# Altium project RezzGlassesControlCircuit_V1.PrjPcb
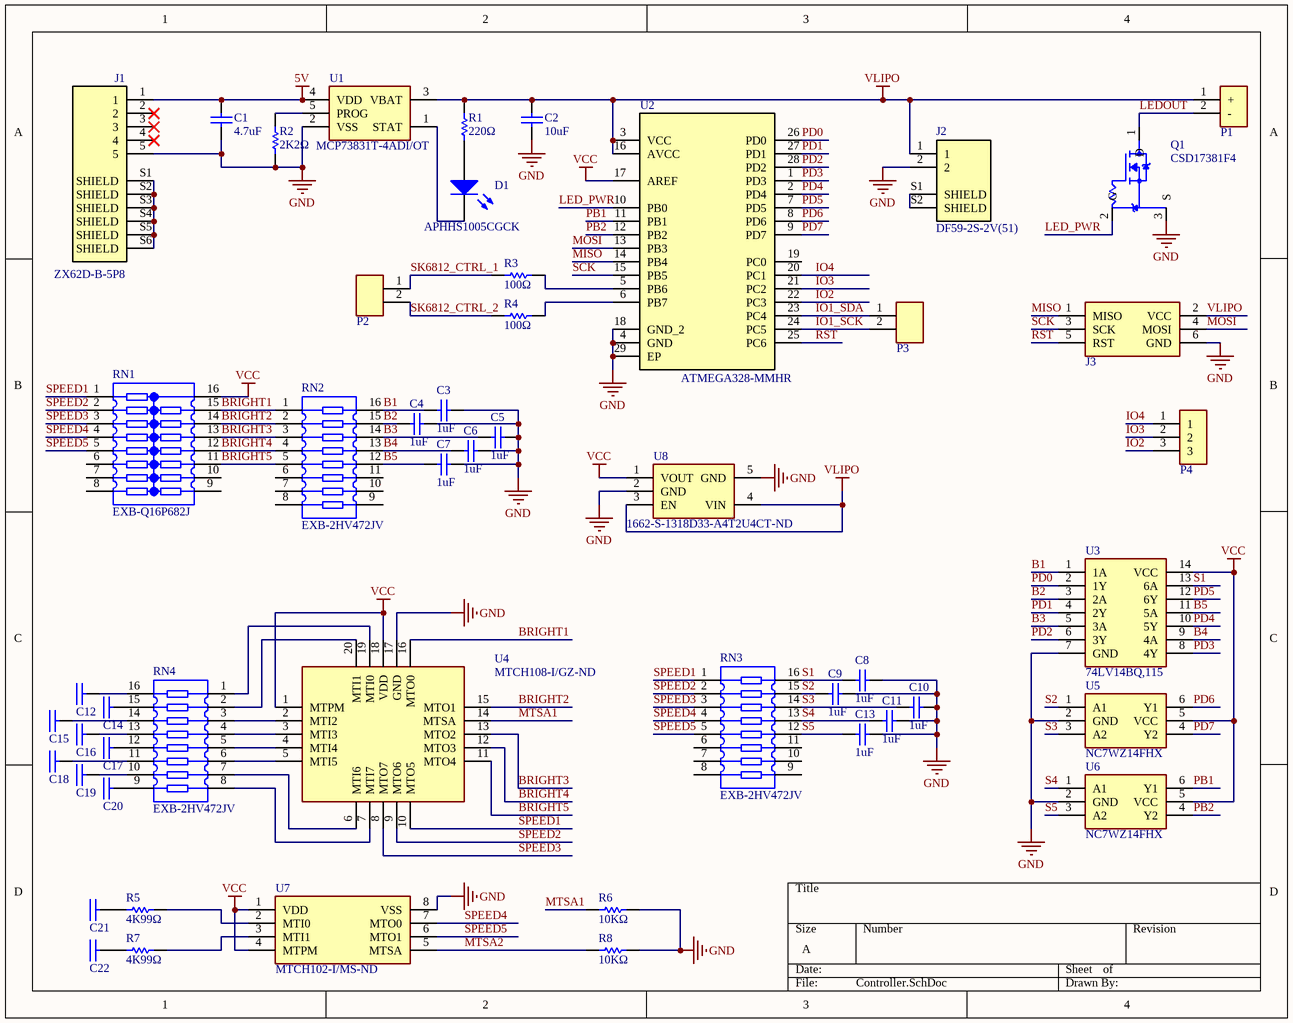
[diagram p0: Controller.SchDoc]
1 sheet, 51 parts. Net scope: global (net labels, ports and power ports of the same name join across sheets).
Board file: ControllerMain_V1.PcbDoc

## Sheet Controller.SchDoc
size A; SheetNumber: 1; SheetTotal: 4

### Parts
C1  4.7uF  [0603_CAP]
C2  10uF  [0603_CAP]
C3  1uF  [0603_CAP]
C4  1uF  [0603_CAP]
C5  1uF  [0603_CAP]
C6  1uF  [0603_CAP]
C7  1uF  [0603_CAP]
C8  1uF  [0603_CAP]
C9  1uF  [0603_CAP]
C10  1uF  [0603_CAP]
C11  1uF  [0603_CAP]
C12  Human Body Model  [TOUCHSENSE_SLIDE1-END2]  (value not drawn)
C13  1uF  [0603_CAP]
C14  Human Body Model  [TOUCHSENSE_SLIDE1]  (value not drawn)
C15  Human Body Model  [TOUCHSENSE_SLIDE1]  (value not drawn)
C16  Human Body Model  [TOUCHSENSE_SLIDE1]  (value not drawn)
C17  Human Body Model  [TOUCHSENSE_SLIDE1]  (value not drawn)
C18  Human Body Model  [TOUCHSENSE_SLIDE1]  (value not drawn)
C19  Human Body Model  [TOUCHSENSE_SLIDE1]  (value not drawn)
C20  Human Body Model  [TOUCHSENSE_SLIDE1]  (value not drawn)
C21  Human Body Model  [TOUCHSENSE_SLIDE1]  (value not drawn)
C22  Human Body Model  [TOUCHSENSE_SLIDE1-END1]  (value not drawn)
D1  APHHS1005CGCK  [0402-LED-G]
J1  ZX62D-B-5P8  [Micro_USB]
J2  DF59-2S-2V(51)  [SNAPBEE_DF59-2S-2V]
J3  6 Pin ISP Header  [CONN_ISP_TINY]  (value not drawn)
P1  HEADER_1x2_POLAR  [PIN2]  (value not drawn)
P2  HEADER_1x2  [PIN2]  (value not drawn)
P3  HEADER_1x2  [PIN2]  (value not drawn)
P4  HEADER_1x3  [PIN3]  (value not drawn)
Q1  CSD17381F4  [PICOSTAR-3]
R1  220Ω  [0603_RES]
R2  2K2Ω  [0603_RES]
R3  100Ω  [0603_RES]
R4  100Ω  [0603_RES]
R5  4K99Ω  [0603_RES]
R6  10KΩ  [0603_RES]
R7  4K99Ω  [0603_RES]
R8  10KΩ  [0603_RES]
RN1  EXB-Q16P682J  [RES-ARRAY-16_EXB]
RN2  EXB-2HV472JV  [RES-ARRAY-16_EXB]
RN3  EXB-2HV472JV  [RES-ARRAY-16_EXB]
RN4  EXB-2HV472JV  [RES-ARRAY-16_EXB]
U1  MCP73831T-4ADI/OT  [SOT-23-5-N]
U2  ATMEGA328-MMHR  [QFN-28_4x4]
U3  74LV14BQ,115  [DHVQFN-14]
U4  Supplier Part Number 1: MTCH108-I/GZ-ND  [UQFN-20_4x4]  (hidden comment: MTCH108-I/GZ)
U5  NC7WZ14FHX  [MICROPAK2]
U6  NC7WZ14FHX  [MICROPAK2]
U7  Supplier Part Number 1: MTCH102-I/MS-ND  [MSOP-8]  (hidden comment: MTCH102-I/MS)
U8  Supplier Part Number 1: 1662-S-1318D33-A4T2U4CT-ND  [HSNT-4-B]  (hidden comment: S-1318D33-A4T2U4)

### Nets
5V: C1.2 J1.1 U1.4(VDD)
GND: C1.1 C2.1 C3.1 C4.1 C5.1 C6.1 C7.2 C8.1 C9.1 C10.1 C11.1 C13.2 J1.5 J2.2 J3.6(GND) Q1.3(S) R2.1 R6.1 R8.2 U1.2(VSS) U2.4(GND) U2.18(GND_2) U2.29(EP) U3.7(GND) U4.17(GND) U5.2(GND) U6.2(GND) U7.8(VSS) U8.2(GND) U8.5(GND)
VCC: RN1.16 U2.17(AREF) U3.14(VCC) U4.1(MTPM) U4.18(VDD) U5.5(VCC) U6.5(VCC) U7.1(VDD) U7.4(MTPM) U8.1(VOUT)
VLIPO: C2.2 J2.1 J3.2(VCC) P1.1(+) R1.2 U1.3(VBAT) U2.3(VCC) U2.16(AVCC) U8.3(EN) U8.4(VIN)
B1: C3.2 RN2.16 U3.1(1A)
B2: C4.2 RN2.15 U3.3(2A)
B3: C5.2 RN2.14 U3.5(3A)
B4: C6.2 RN2.13 U3.9(4A)
B5: C7.1 RN2.12 U3.11(5A)
BRIGHT1: RN1.15 RN2.1 U4.16(MTO0)
BRIGHT2: RN1.14 RN2.2 U4.15(MTO1)
BRIGHT3: RN1.13 RN2.3 U4.13(MTO2)
BRIGHT4: RN1.12 RN2.4 U4.12(MTO3)
BRIGHT5: RN1.11 RN2.5 U4.11(MTO4)
IO1_SCK: P3.2(-) U2.24(PC5)
IO1_SDA: P3.1(+) U2.23(PC4)
IO2: P4.3 U2.22(PC3)
IO3: P4.2 U2.21(PC2)
IO4: P4.1 U2.20(PC1)
LED_PWR: Q1.2(G) U2.10(PB0)
LEDOUT: P1.2(-) Q1.1(D)
MISO: J3.1(MISO) U2.14(PB4)
MOSI: J3.4(MOSI) U2.13(PB3)
MTSA1: R6.2 U4.14(MTSA)
MTSA2: R8.1 U7.5(MTSA)
PB1: U2.11(PB1) U6.6(Y1)
PB2: U2.12(PB2) U6.4(Y2)
PD0: U2.26(PD0) U3.2(1Y)
PD1: U2.27(PD1) U3.4(2Y)
PD2: U2.28(PD2) U3.6(3Y)
PD3: U2.1(PD3) U3.8(4Y)
PD4: U2.2(PD4) U3.10(5Y)
PD5: U2.7(PD5) U3.12(6Y)
PD6: U2.8(PD6) U5.6(Y1)
PD7: U2.9(PD7) U5.4(Y2)
RST: J3.5(RST) U2.25(PC6)
S1: C8.2 RN3.16 U3.13(6A)
S2: C9.2 RN3.15 U5.1(A1)
S3: C10.2 RN3.14 U5.3(A2)
S4: C11.2 RN3.13 U6.1(A1)
S5: C13.1 RN3.12 U6.3(A2)
SCK: J3.3(SCK) U2.15(PB5)
SK6812_CTRL_1: P2.1(+) R3.1
SK6812_CTRL_2: P2.2(-) R4.1
SPEED1: RN1.1 RN3.1 U4.10(MTO5)
SPEED2: RN1.2 RN3.2 U4.9(MTO6)
SPEED3: RN1.3 RN3.3 U4.8(MTO7)
SPEED4: RN1.4 RN3.4 U7.7(MTO0)
SPEED5: RN1.5 RN3.5 U7.6(MTO1)
NetC12_1: C12.1 RN4.16
NetC14_1: C14.1 RN4.15
NetC15_1: C15.1 RN4.14
NetC16_1: C16.1 RN4.13
NetC17_1: C17.1 RN4.12
NetC18_1: C18.1 RN4.11
NetC19_1: C19.1 RN4.10
NetC20_1: C20.1 RN4.9
NetC21_1: C21.1 R5.1
NetC22_1: C22.1 R7.1
NetD1_1: D1.1(K) U1.1(STAT)
NetD1_2: D1.2(A) R1.1
NetJ1_S1: J1.S1(SHIELD) J1.S2(SHIELD) J1.S3(SHIELD) J1.S4(SHIELD) J1.S5(SHIELD) J1.S6(SHIELD)
NetJ2_S1: J2.S1(SHIELD) J2.S2(SHIELD)
NetR2_2: R2.2 U1.5(PROG)
NetR3_2: R3.2 U2.5(PB6)
NetR4_2: R4.2 U2.6(PB7)
NetR5_2: R5.2 U7.2(MTI0)
NetR7_2: R7.2 U7.3(MTI1)
NetRN4_1: RN4.1 U4.19(MTI0)
NetRN4_2: RN4.2 U4.20(MTI1)
NetRN4_3: RN4.3 U4.2(MTI2)
NetRN4_4: RN4.4 U4.3(MTI3)
NetRN4_5: RN4.5 U4.4(MTI4)
NetRN4_6: RN4.6 U4.5(MTI5)
NetRN4_7: RN4.7 U4.6(MTI6)
NetRN4_8: RN4.8 U4.7(MTI7)

Not connected (* = marked no-connect by the designer): J1 2* 3* 4*; RN1 6 7 8 9 10; RN2 6 7 8 9 10 11; RN3 6 7 8 9 10 11; U2 19(PC0)

### Library data of the parts
C1 = CAP_4U7_0603: CAP CER 4.7UF 25V X5R 0603; Published: 8-Jun-2000; LatestRevisionDate: 17-Jul-2002; LatestRevisionNote: Re-released for DXP Platform.; PackageReference: RAD-0.3; Publisher: Altium Limited; PackageDescription: Radial Cap, Thru-Hole; 2 Leads; 0.3 in Pin Spacing; Supplier 1: Digi-Key; Supplier Part Number 1: 445-9050-1-ND
C2 = CAP_10U_0603: CAP CER 10UF 10V X5R 0603; Published: 8-Jun-2000; LatestRevisionDate: 17-Jul-2002; LatestRevisionNote: Re-released for DXP Platform.; PackageReference: RAD-0.3; Publisher: Altium Limited; PackageDescription: Radial Cap, Thru-Hole; 2 Leads; 0.3 in Pin Spacing; Supplier 1: Digi-Key; Supplier Part Number 1: 490-10474-1-ND
C3-C11 C13 = CAP_1U_0603: CAP CER 1UF 50V X7R 0603; Published: 8-Jun-2000; LatestRevisionDate: 17-Jul-2002; LatestRevisionNote: Re-released for DXP Platform.; PackageReference: RAD-0.3; Publisher: Altium Limited; PackageDescription: Radial Cap, Thru-Hole; 2 Leads; 0.3 in Pin Spacing; Supplier 1: Digi-Key; Supplier Part Number 1: 490-12330-1-ND
C12 = CAP_TOUCH_SLIDE1_END2: Touch Sensor Pad, Slide Style 1; Published: 8-Jun-2000; LatestRevisionDate: 17-Jul-2002; LatestRevisionNote: Re-released for DXP Platform.; Publisher: Altium Limited; PackageDescription: Radial Cap, Thru-Hole; 2 Leads; 0.3 in Pin Spacing; PackageReference: RAD-0.3
C14-C21 = CAP_TOUCH_SLIDE1: Touch Sensor Pad, Slide Style 1; Published: 8-Jun-2000; LatestRevisionDate: 17-Jul-2002; LatestRevisionNote: Re-released for DXP Platform.; Publisher: Altium Limited; PackageDescription: Radial Cap, Thru-Hole; 2 Leads; 0.3 in Pin Spacing; PackageReference: RAD-0.3
C22 = CAP_TOUCH_SLIDE1_END1: Touch Sensor Pad, Slide Style 1; Published: 8-Jun-2000; LatestRevisionDate: 17-Jul-2002; LatestRevisionNote: Re-released for DXP Platform.; Publisher: Altium Limited; PackageDescription: Radial Cap, Thru-Hole; 2 Leads; 0.3 in Pin Spacing; PackageReference: RAD-0.3
D1 = APHHS1005CGCK: LED GREEN CLEAR CHIP SMD; Supplier 1: Digi-Key; Supplier Part Number 1: 754-1101-1-ND
J1 = MicroUSB: SMD+DIP Micro USB; MICRO-B-SMD; MF: Hirose; SnapEDA_Link: https://www.snapeda.com/parts/ZX62D-B-5P8/Hirose%20Electric%20Co%20Ltd/view-part/?ref=snap; Package: None; Price: None; MP: ZX62D-B-5P8; Availability: Unavailable; Value: *; Supplier 1: Digi-Key; Supplier Part Number 1: H125272CT-ND
J2 = SNAPBEE_DF59-2S-2V: CONN SSL RCPT 2POS 2MM SOLDER; Supplier 1: Digi-Key; Supplier 2: Digi-Key; Supplier 3: Digi-Key; Supplier Part Number 1: H11961CT-ND; Supplier Part Number 2: H11958-ND; Supplier Part Number 3: H11957CT-ND
J3 = ISP_TINY
P1 = HEADER_1x2_POLAR: Polarity
Q1 = CSD17381F4: MOSFET N-CH 30V 3.1A 3PICOSTAR; MF: {'manufacturer': u'Texas Instruments'}; Package: None; MP: CSD17381F4; Value: *; Availability: Unavailable; Price: None; Supplier 1: Digi-Key; Supplier Part Number 1: 296-38913-1-ND
R1 = RES_220R_0603: RES SMD 220 OHM 1% 1/10W 0603; Published: 8-Jun-2000; LatestRevisionDate: 17-Jul-2002; LatestRevisionNote: Re-released for DXP Platform.; PackageReference: AXIAL-0.3; Publisher: Altium Limited; PackageDescription: Axial Device, Thru-Hole; 2 Leads; 0.3 in Pin Spacing; Supplier 1: Digi-Key; Supplier Part Number 1: 541-220HCT-ND
R2 = RES_2K2_0603: RES SMD 2.2K OHM 1% 1/10W 0603; Published: 8-Jun-2000; LatestRevisionDate: 17-Jul-2002; LatestRevisionNote: Re-released for DXP Platform.; PackageReference: AXIAL-0.3; Publisher: Altium Limited; PackageDescription: Axial Device, Thru-Hole; 2 Leads; 0.3 in Pin Spacing; Supplier 1: Digi-Key; Supplier Part Number 1: 311-2.20KHRCT-ND
R3 R4 = RES_100R_0603: RES SMD 100 OHM 1% 1/10W 0603; Published: 8-Jun-2000; LatestRevisionDate: 17-Jul-2002; LatestRevisionNote: Re-released for DXP Platform.; PackageReference: AXIAL-0.3; Publisher: Altium Limited; PackageDescription: Axial Device, Thru-Hole; 2 Leads; 0.3 in Pin Spacing; Supplier 1: Digi-Key; Supplier Part Number 1: 311-100HRCT-ND
R5 R7 = RES_4K99_0603: RES SMD 4.99K OHM 1% 1/10W 0603; Published: 8-Jun-2000; LatestRevisionDate: 17-Jul-2002; LatestRevisionNote: Re-released for DXP Platform.; PackageReference: AXIAL-0.3; Publisher: Altium Limited; PackageDescription: Axial Device, Thru-Hole; 2 Leads; 0.3 in Pin Spacing; Supplier 1: Digi-Key; Supplier Part Number 1: 541-4.99KHCT-ND
R6 R8 = RES_10K_0603: RES SMD 10K OHM 1% 1/10W 0603; Published: 8-Jun-2000; LatestRevisionDate: 17-Jul-2002; LatestRevisionNote: Re-released for DXP Platform.; PackageReference: AXIAL-0.3; Publisher: Altium Limited; PackageDescription: Axial Device, Thru-Hole; 2 Leads; 0.3 in Pin Spacing; Supplier 1: Digi-Key; Supplier Part Number 1: 311-10.0KHRCT-ND
RN1 = EXB-Q16P682J: RES ARRAY 15 RES 6.8K OHM 1506; MF: {'manufacturer': u'Panasonic'}; Package: None; Price: None; Value: *; MP: EXB-Q16P682J; Availability: Unavailable; Supplier 1: Digi-Key; Supplier Part Number 1: U6682CT-ND
RN2-RN4 = EXB-2HV472JV: RES ARRAY 8 RES 4.7K OHM 1506; MF: {'manufacturer': u'Panasonic'}; MP: EXB-Q16P682J; Package: None; Price: None; Value: *; Availability: Unavailable; Supplier 1: Digi-Key; Supplier Part Number 1: Y1472CT-ND
U1 = MCP73831T-4ADI/OT: IC BATT CNTL LI-ION 1CEL SOT23-5; MF: {'manufacturer': u'Microchip'}; Value: *; Price: None; Availability: Unavailable; Package: None; MP: MCP73831T-4ADI/OT; Supplier 1: Digi-Key; Supplier Part Number 1: MCP73831T-4ADI/OTCT-ND
U2 = ATMEGA328-MMHR: IC MCU 8BIT 32KB FLASH 28VQFN; MF: Microchip; MP: ATMEGA328P-PU; SnapEDA_Link: https://www.snapeda.com/parts/ATMEGA328P-PU/Microchip/view-part/?ref=snap; Package: PDIP-28 Microchip; Price: None; Availability: Unavailable; Value: *; Supplier 1: Digi-Key; Supplier Part Number 1: ATMEGA328-MMHRCT-ND
U3 = 74LV14BQ,115: IC INVERTER 6CH 6-INP 14DHVQFN; Supplier 1: Digi-Key; Supplier Part Number 1: 1727-6943-1-ND
U4 = MTCH108-I/GZ: IC PROXIMITY DETECTOR 20UQFN; Supplier 1: Digi-Key
U5 U6 = NC7WZ14FHX: IC INVERTER 2CH 2-INP 6MICROPAK2; Supplier 1: Digi-Key; Supplier Part Number 1: NC7WZ14FHXCT-ND
U7 = MTCH102-I/MS: IC PROXIMITY DETECTOR 8MSOP; Supplier 1: Digi-Key
U8 = S-1318D33-A4T2U4: IC REG LINEAR 3.3V 100MA HSNT4-B; Supplier 1: Digi-Key